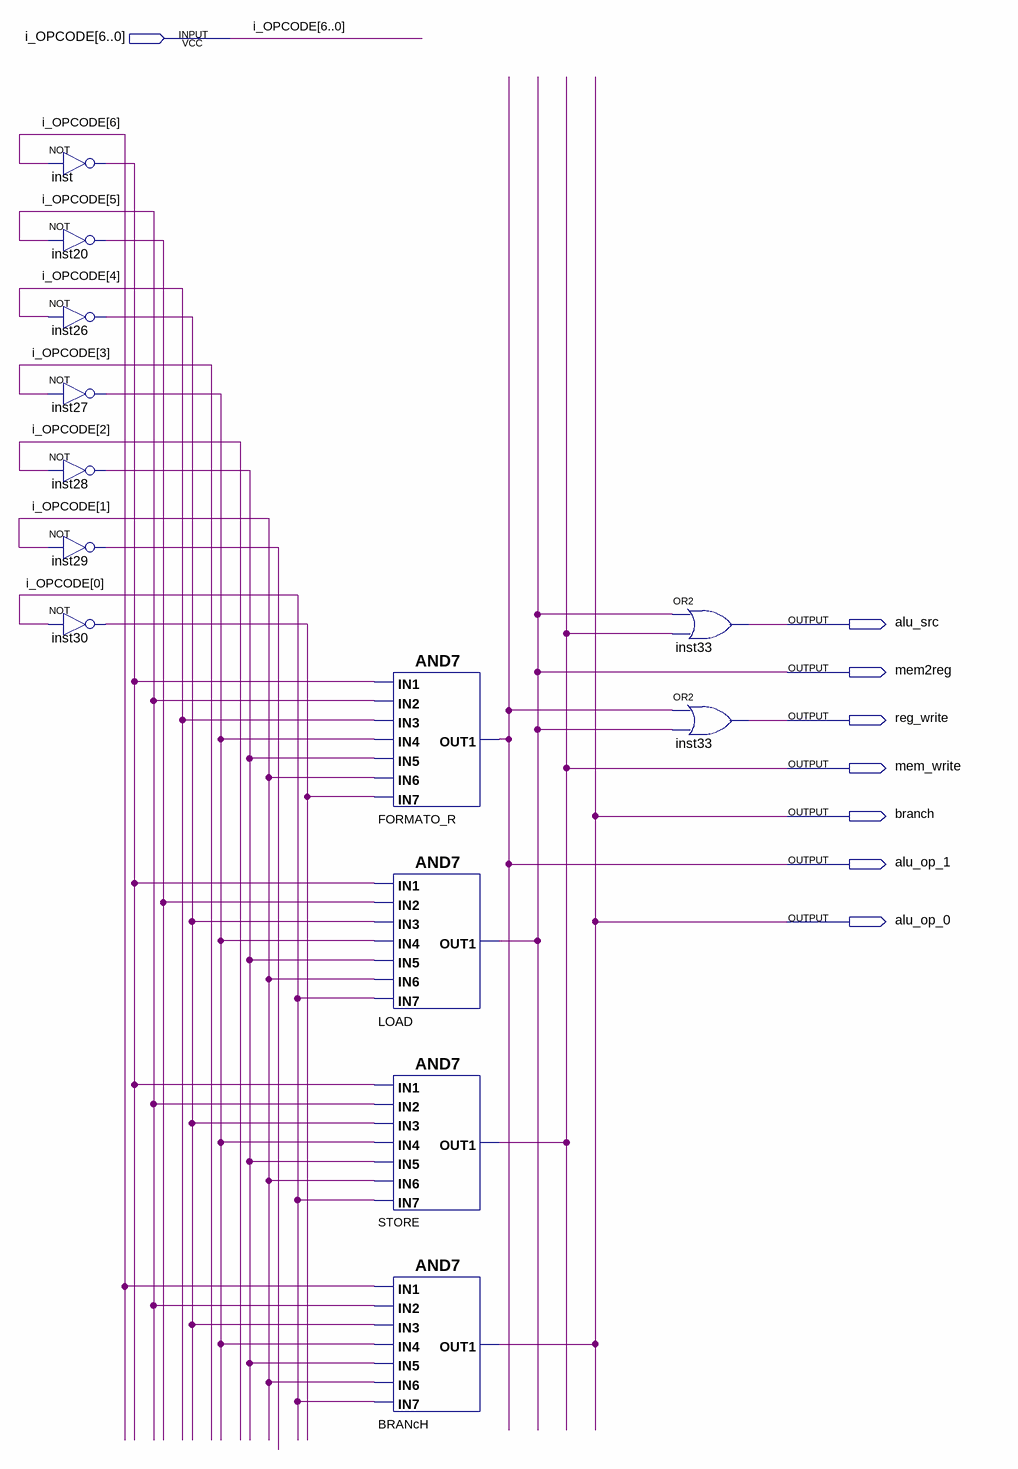
[diagram p0: schematic sheet]
// Quartus schematic Controle.bdf as structural Verilog: 13 symbols, 8 pins
module Controle (
  input  [6:0] i_OPCODE,
  output alu_src,
  output mem2reg,
  output reg_write,
  output mem_write,
  output branch,
  output alu_op_1,
  output alu_op_0
);

  wire inst20_out, inst26_out, inst27_out, inst28_out, inst29_out, inst30_out, inst_out;

  not inst (inst_out, i_OPCODE[6]);
  not inst20 (inst20_out, i_OPCODE[5]);
  not inst26 (inst26_out, i_OPCODE[4]);
  not inst27 (inst27_out, i_OPCODE[3]);
  not inst28 (inst28_out, i_OPCODE[2]);
  not inst29 (inst29_out, i_OPCODE[1]);
  not inst30 (inst30_out, i_OPCODE[0]);
  AND7 FORMATO_R (
    .IN7(inst30_out), .IN6(i_OPCODE[1]), .IN5(inst28_out), .IN3(i_OPCODE[4]), .IN4(inst27_out),
    .IN1(inst_out), .IN2(i_OPCODE[5]), .OUT1(alu_op_1));
  AND7 LOAD (
    .IN7(i_OPCODE[0]), .IN6(i_OPCODE[1]), .IN5(inst28_out), .IN3(inst26_out), .IN4(inst27_out),
    .IN1(inst_out), .IN2(inst20_out), .OUT1(mem2reg));
  AND7 STORE (
    .IN7(i_OPCODE[0]), .IN6(i_OPCODE[1]), .IN5(inst28_out), .IN3(inst26_out), .IN4(inst27_out),
    .IN1(inst_out), .IN2(i_OPCODE[5]), .OUT1(mem_write));
  AND7 u_BRANcH (
    .IN7(i_OPCODE[0]), .IN6(i_OPCODE[1]), .IN5(inst28_out), .IN3(inst26_out), .IN4(inst27_out),
    .IN1(i_OPCODE[6]), .IN2(i_OPCODE[5]), .OUT1(alu_op_0));
  or inst33 (alu_src, mem2reg, mem_write);
  or inst33_dup2 (reg_write, alu_op_1, mem2reg);

  assign branch = alu_op_0;
endmodule
